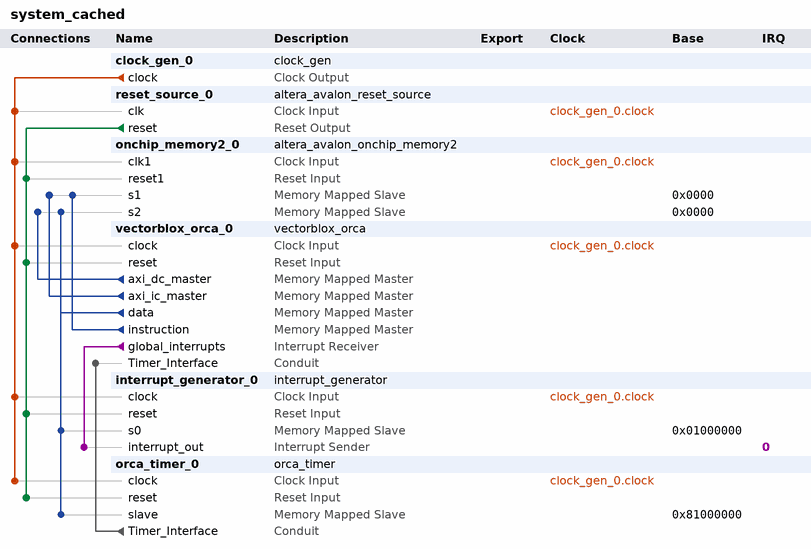
[diagram p0: system contents]
# Platform Designer (Qsys) system system_cached, Cyclone IV E Unknown
# Parameters at their usual value, and those the tool derives, are not listed.
package require -exact qsys 17.0
create_system system_cached
set_project_property DEVICE_FAMILY {Cyclone IV E}
set_project_property DEVICE Unknown

add_instance clock_gen_0 clock_gen 1.0
set_instance_parameter_value clock_gen_0 CLK_MHZ 100

add_instance reset_source_0 altera_avalon_reset_source 17.0
set_instance_parameter_value reset_source_0 ASSERT_HIGH_RESET 1
set_instance_parameter_value reset_source_0 INITIAL_RESET_CYCLES 6

add_instance onchip_memory2_0 altera_avalon_onchip_memory2 17.0
set_instance_parameter_value onchip_memory2_0 dataWidth 32
set_instance_parameter_value onchip_memory2_0 dualPort true
set_instance_parameter_value onchip_memory2_0 initMemContent true
set_instance_parameter_value onchip_memory2_0 initializationFileName test.hex
set_instance_parameter_value onchip_memory2_0 memorySize 65536
set_instance_parameter_value onchip_memory2_0 singleClockOperation true
set_instance_parameter_value onchip_memory2_0 useNonDefaultInitFile true

add_instance vectorblox_orca_0 vectorblox_orca 1.0
set_instance_parameter_value vectorblox_orca_0 AMR0_ADDR_BASE 16777216
set_instance_parameter_value vectorblox_orca_0 AMR0_ADDR_LAST 4294967295
set_instance_parameter_value vectorblox_orca_0 AUX_MEMORY_REGIONS 1
set_instance_parameter_value vectorblox_orca_0 AXI_ID_WIDTH 2
set_instance_parameter_value vectorblox_orca_0 BTB_ENTRIES 16
set_instance_parameter_value vectorblox_orca_0 COUNTER_LENGTH 64
set_instance_parameter_value vectorblox_orca_0 DATA_REQUEST_REGISTER 0
set_instance_parameter_value vectorblox_orca_0 DATA_RETURN_REGISTER 0
set_instance_parameter_value vectorblox_orca_0 DAUX_REQUEST_REGISTER 2
set_instance_parameter_value vectorblox_orca_0 DAUX_RETURN_REGISTER 1
set_instance_parameter_value vectorblox_orca_0 DCACHE_EXTERNAL_WIDTH 32
set_instance_parameter_value vectorblox_orca_0 DCACHE_LINE_SIZE 32
set_instance_parameter_value vectorblox_orca_0 DCACHE_SIZE 8192
set_instance_parameter_value vectorblox_orca_0 DCACHE_WRITEBACK 0
set_instance_parameter_value vectorblox_orca_0 DC_REQUEST_REGISTER 1
set_instance_parameter_value vectorblox_orca_0 DC_RETURN_REGISTER 0
set_instance_parameter_value vectorblox_orca_0 DIVIDE_ENABLE 1
set_instance_parameter_value vectorblox_orca_0 DUC_REQUEST_REGISTER 2
set_instance_parameter_value vectorblox_orca_0 DUC_RETURN_REGISTER 1
set_instance_parameter_value vectorblox_orca_0 ENABLE_EXCEPTIONS 1
set_instance_parameter_value vectorblox_orca_0 ENABLE_EXT_INTERRUPTS 1
set_instance_parameter_value vectorblox_orca_0 FAMILY ALTERA
set_instance_parameter_value vectorblox_orca_0 IAUX_REQUEST_REGISTER 0
set_instance_parameter_value vectorblox_orca_0 IAUX_RETURN_REGISTER 0
set_instance_parameter_value vectorblox_orca_0 ICACHE_EXTERNAL_WIDTH 32
set_instance_parameter_value vectorblox_orca_0 ICACHE_LINE_SIZE 32
set_instance_parameter_value vectorblox_orca_0 ICACHE_SIZE 8192
set_instance_parameter_value vectorblox_orca_0 IC_REQUEST_REGISTER 1
set_instance_parameter_value vectorblox_orca_0 IC_RETURN_REGISTER 0
set_instance_parameter_value vectorblox_orca_0 INSTRUCTION_REQUEST_REGISTER 0
set_instance_parameter_value vectorblox_orca_0 INSTRUCTION_RETURN_REGISTER 0
set_instance_parameter_value vectorblox_orca_0 INTERRUPT_VECTOR 4
set_instance_parameter_value vectorblox_orca_0 IUC_REQUEST_REGISTER 0
set_instance_parameter_value vectorblox_orca_0 IUC_RETURN_REGISTER 0
set_instance_parameter_value vectorblox_orca_0 LOG2_BURSTLENGTH 4
set_instance_parameter_value vectorblox_orca_0 MAX_IFETCHES_IN_FLIGHT 4
set_instance_parameter_value vectorblox_orca_0 MULTIPLY_ENABLE 1
set_instance_parameter_value vectorblox_orca_0 NUM_EXT_INTERRUPTS 1
set_instance_parameter_value vectorblox_orca_0 PIPELINE_STAGES 4
set_instance_parameter_value vectorblox_orca_0 POWER_OPTIMIZED 0
set_instance_parameter_value vectorblox_orca_0 REGISTER_SIZE 32
set_instance_parameter_value vectorblox_orca_0 RESET_VECTOR 0
set_instance_parameter_value vectorblox_orca_0 SHIFTER_MAX_CYCLES 32
set_instance_parameter_value vectorblox_orca_0 UC_MEMORY_REGIONS 0
set_instance_parameter_value vectorblox_orca_0 UMR0_ADDR_BASE 0
set_instance_parameter_value vectorblox_orca_0 UMR0_ADDR_LAST 0
set_instance_parameter_value vectorblox_orca_0 VCP_ENABLE 0

add_instance interrupt_generator_0 interrupt_generator 1.0

add_instance orca_timer_0 orca_timer 1.0
set_instance_parameter_value orca_timer_0 TIMER_WIDTH 64

# connections
add_connection clock_gen_0.clock interrupt_generator_0.clock clock
add_connection clock_gen_0.clock onchip_memory2_0.clk1 clock
add_connection clock_gen_0.clock orca_timer_0.clock clock
add_connection clock_gen_0.clock reset_source_0.clk clock
add_connection clock_gen_0.clock vectorblox_orca_0.clock clock
add_connection reset_source_0.reset interrupt_generator_0.reset reset
add_connection reset_source_0.reset onchip_memory2_0.reset1 reset
add_connection reset_source_0.reset orca_timer_0.reset reset
add_connection reset_source_0.reset vectorblox_orca_0.reset reset
add_connection vectorblox_orca_0.axi_dc_master onchip_memory2_0.s2 avalon
set_connection_parameter_value vectorblox_orca_0.axi_dc_master/onchip_memory2_0.s2 baseAddress 0x0000
add_connection vectorblox_orca_0.axi_ic_master onchip_memory2_0.s1 avalon
set_connection_parameter_value vectorblox_orca_0.axi_ic_master/onchip_memory2_0.s1 baseAddress 0x0000
add_connection vectorblox_orca_0.data interrupt_generator_0.s0 avalon
set_connection_parameter_value vectorblox_orca_0.data/interrupt_generator_0.s0 baseAddress 0x01000000
add_connection vectorblox_orca_0.data onchip_memory2_0.s2 avalon
set_connection_parameter_value vectorblox_orca_0.data/onchip_memory2_0.s2 baseAddress 0x0000
add_connection vectorblox_orca_0.data orca_timer_0.slave avalon
set_connection_parameter_value vectorblox_orca_0.data/orca_timer_0.slave baseAddress 0x81000000
add_connection vectorblox_orca_0.instruction onchip_memory2_0.s1 avalon
set_connection_parameter_value vectorblox_orca_0.instruction/onchip_memory2_0.s1 baseAddress 0x0000
add_connection orca_timer_0.Timer_Interface vectorblox_orca_0.Timer_Interface conduit
add_connection vectorblox_orca_0.global_interrupts interrupt_generator_0.interrupt_out interrupt
set_connection_parameter_value vectorblox_orca_0.global_interrupts/interrupt_generator_0.interrupt_out irqNumber 0

set_interconnect_requirement {$system} qsys_mm.clockCrossingAdapter HANDSHAKE
set_interconnect_requirement {$system} qsys_mm.insertDefaultSlave FALSE
set_interconnect_requirement {$system} qsys_mm.maxAdditionalLatency 0

save_system system_cached.qsys
